# Altium schematic sheet SD.SchDoc
size A4; SheetNumber: 8; SheetTotal: 21
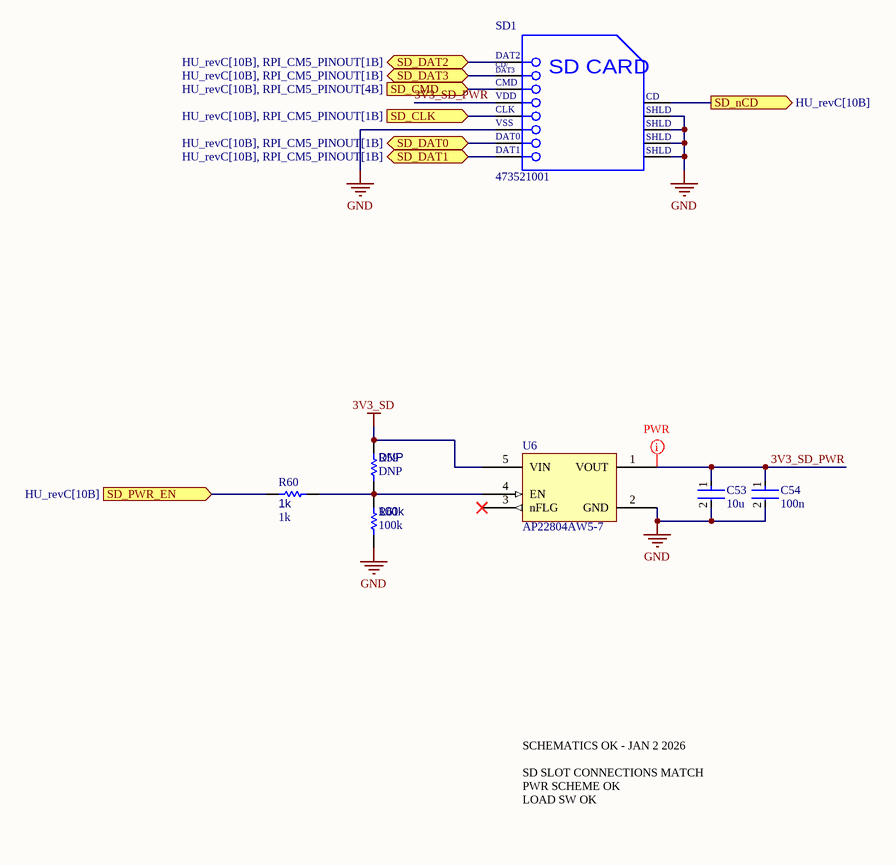
[diagram p0: SD.SchDoc]

## Parts
C53  10u  [FP-0402-L_1_0_0_05-W_0_5-IPC_A]
C54  100n  [FP-0402-L_1_0_0_05-W_0_5-IPC_A]
R59  DNP  [R0603B]
R60  1k  [R0603B]
R61  100k  [R0603B]
SD1  473521001  [MOLX-473521001_V]
U6  AP22804AW5-7  [SOT95P285X140-5N]

## Ports
SD_CLK (in, see HU_revC[10B], RPI_CM5_PINOUT[1B]), SD_CMD (in, see HU_revC[10B], RPI_CM5_PINOUT[4B]), SD_DAT0 (bidir, see HU_revC[10B], RPI_CM5_PINOUT[1B]), SD_DAT1 (bidir, see HU_revC[10B], RPI_CM5_PINOUT[1B]), SD_DAT2 (bidir, see HU_revC[10B], RPI_CM5_PINOUT[1B]), SD_DAT3 (bidir, see HU_revC[10B], RPI_CM5_PINOUT[1B]), SD_nCD (out, see HU_revC[10B]), SD_PWR_EN (in, see HU_revC[10B])

## Nets
3V3_SD: R59.2 U6.5(VIN)
GND: C53.2 C54.2 R61.1 SD1.6(VSS) SD1.10(SHLD) SD1.11(SHLD) SD1.12(SHLD) SD1.13(SHLD) U6.2(GND)
3V3_SD_PWR: C53.1 C54.1 SD1.4(VDD) U6.1(VOUT)
SD_CLK: SD1.5(CLK) ; port SD_CLK
SD_CMD: SD1.3(CMD) ; port SD_CMD
SD_DAT0: SD1.7(DAT0) ; port SD_DAT0
SD_DAT1: SD1.8(DAT1) ; port SD_DAT1
SD_DAT2: SD1.1(DAT2) ; port SD_DAT2
SD_DAT3: SD1.2(CD/DAT3) ; port SD_DAT3
SD_nCD: SD1.9(CD) ; port SD_nCD
SD_PWR_EN: R60.2 ; port SD_PWR_EN
NetR59_1: R59.1 R60.1 R61.2 U6.4(EN)

Not connected (* = marked no-connect by the designer): U6 3(nFLG)*

## Layout directives
net class PWR: 3V3_SD_PWR

## Notes on the sheet
- SCHEMATICS OK - JAN 2 2026
  SD SLOT CONNECTIONS MATCH
  PWR SCHEME OK
  LOAD SW OK
- (in symbol CMP-2000-05848-1) CD/; DAT3; SD CARD

## Library data of the parts
C53 C54 = CMP-001-00058-1: LARGE PADS, 0402 CAP, CHANGE COMMENT TO MATCH REAL P/N; Capacitor Type: Ceramic; Min Operating Temperature: -55°C; Mounting Technology: Surface Mount; Pins: 2; Case/Package: 0402; RoHS Compliant: Yes; Max Operating Temperature: 85°C
R59-R61 = CMP-009-00002-14: Resistor
  R59: Value: DNP
  R60: Value: 1k
  R61: Value: 100k
SD1 = CMP-2000-05848-1: MicroSD(TM), Pitch 1.1 mm, 8 Position, Height 1.88 mm, -20 to 85 degC, RoHS, Tape and Reel; Manufacturer: Molex; Datasheet Version: Rev. G, 01/2012; Datasheet URL: http://www.molex.com/pdm_docs/sd/473521001_sd.pdf; Package Reference: 473521001; Manufacturer URL: http://www.molex.com/; Mounting Technology: SurfaceMount; Package Description: MicroSD(TM), Pitch 1.1 mm, 8 Position, Height 1.88 mm
U6 = CMP-019-00060-1: SINGLE CHANNEL POWER DISTRIBUTION LOAD SWITCH, -40 to 85°C pF, RoHS; Max Supply Voltage: 5.5V; Min Supply Voltage: 2.7V; Max Operating Temperature: 85°C; Min Operating Temperature: -40°C